# Altium schematic sheet system.SCHDOC
size B
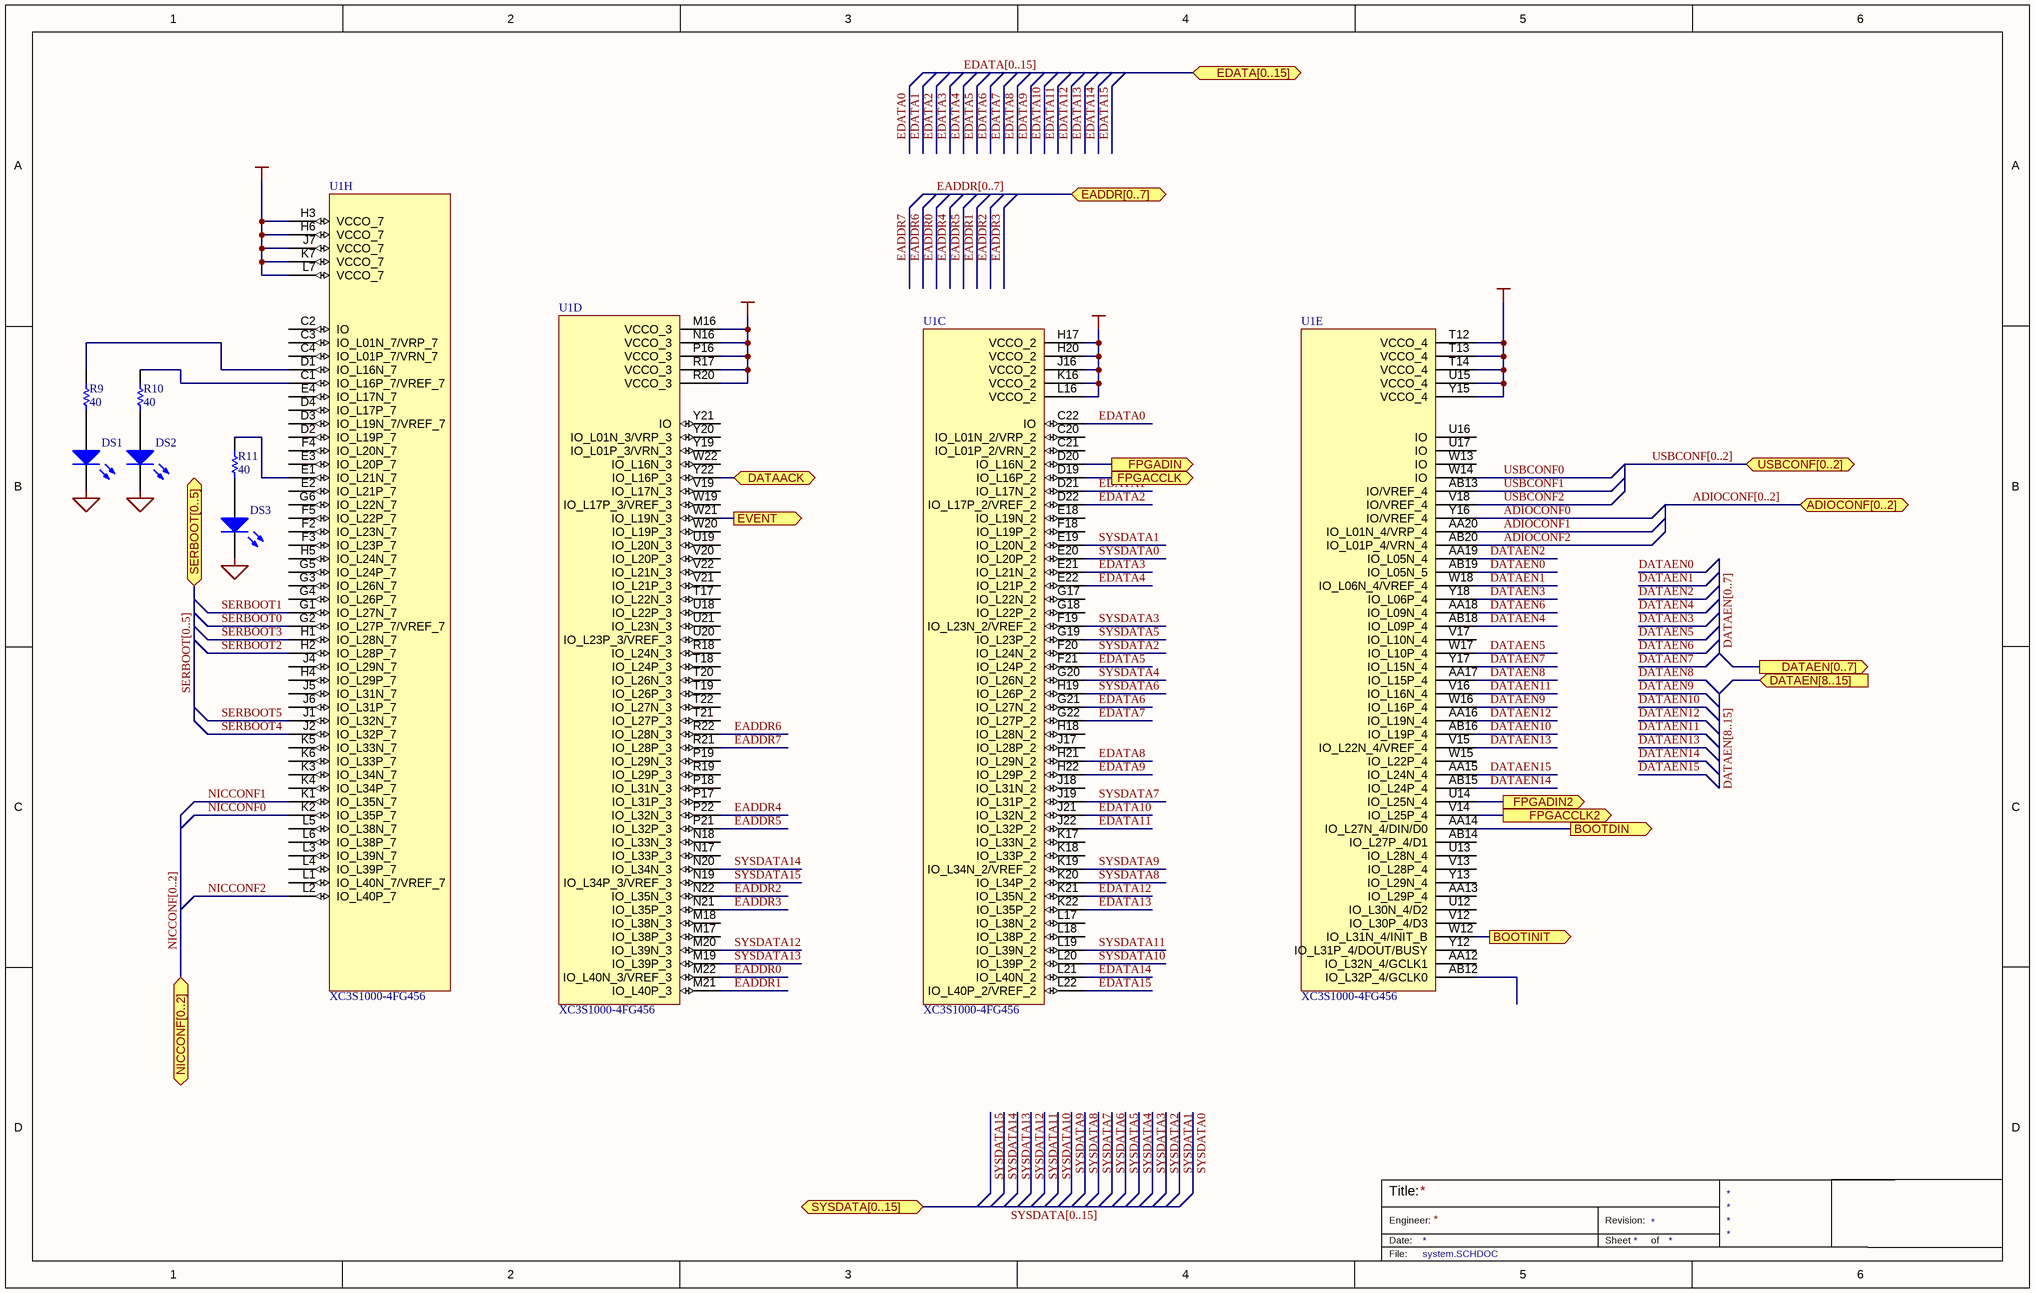
[diagram p0: system.SCHDOC]

## Parts
DS1  LED0  [T-1_LED]  (value not drawn)
DS2  LED0  [T-1_LED]  (value not drawn)
DS3  LED0  [T-1_LED]  (value not drawn)
R9  value 40  [CC1608-0603]  (hidden comment: Res1)
R10  value 40  [CC1608-0603]  (hidden comment: Res1)
R11  value 40  [CC1608-0603]  (hidden comment: Res1)
U1  XC3S1000-4FG456  [FG456]  (parts C,D,E,H of 9)

## Ports
ADIOCONF[0..2] (bidir), BOOTDIN (out), BOOTINIT (out), DATAACK (bidir), DATAEN[0..7] (out), DATAEN[8..15] (in), EADDR[0..7] (bidir), EDATA[0..15] (bidir), EVENT (out), FPGACCLK2 (out), FPGACCLK (out), FPGADIN2 (out), FPGADIN (out), NICCONF[0..2] (bidir), SERBOOT[0..5] (bidir), SYSDATA[0..15] (bidir), USBCONF[0..2] (bidir)

## Nets
GND: DS1.2(K) DS2.2(K) DS3.2(K)
VCC: U1.H3(VCCO_7) U1.H6(VCCO_7) U1.H17(VCCO_2) U1.H20(VCCO_2) U1.J7(VCCO_7) U1.J16(VCCO_2) U1.K7(VCCO_7) U1.K16(VCCO_2) U1.L7(VCCO_7) U1.L16(VCCO_2) U1.M16(VCCO_3) U1.N16(VCCO_3) U1.P16(VCCO_3) U1.R17(VCCO_3) U1.R20(VCCO_3) U1.T12(VCCO_4) U1.T13(VCCO_4) U1.T14(VCCO_4) U1.U15(VCCO_4) U1.Y15(VCCO_4)
ADIOCONF0: U1.Y16(IO/VREF_4)
ADIOCONF1: U1.AA20(IO_L01N_4/VRP_4)
ADIOCONF2: U1.AB20(IO_L01P_4/VRN_4)
BOOTDIN: U1.AA14(IO_L27N_4/DIN/D0) ; port BOOTDIN
BOOTINIT: U1.W12(IO_L31N_4/INIT_B) ; port BOOTINIT
DATAACK: U1.Y22(IO_L16P_3) ; port DATAACK
DATAEN0: U1.AB19(IO_L05N_5)
DATAEN1: U1.W18(IO_L06N_4/VREF_4)
DATAEN2: U1.AA19(IO_L05N_4)
DATAEN3: U1.Y18(IO_L06P_4)
DATAEN4: U1.AB18(IO_L09P_4)
DATAEN5: U1.W17(IO_L10P_4)
DATAEN6: U1.AA18(IO_L09N_4)
DATAEN7: U1.Y17(IO_L15N_4)
DATAEN8: U1.AA17(IO_L15P_4)
DATAEN9: U1.W16(IO_L16P_4)
DATAEN10: U1.AB16(IO_L19P_4)
DATAEN11: U1.V16(IO_L16N_4)
DATAEN12: U1.AA16(IO_L19N_4)
DATAEN13: U1.V15(IO_L22N_4/VREF_4)
DATAEN14: U1.AB15(IO_L24P_4)
DATAEN15: U1.AA15(IO_L24N_4)
EADDR0: U1.M22(IO_L40N_3/VREF_3)
EADDR1: U1.M21(IO_L40P_3)
EADDR2: U1.N22(IO_L35N_3)
EADDR3: U1.N21(IO_L35P_3)
EADDR4: U1.P22(IO_L32N_3)
EADDR5: U1.P21(IO_L32P_3)
EADDR6: U1.R22(IO_L28N_3)
EADDR7: U1.R21(IO_L28P_3)
EDATA0: U1.C22(IO)
EDATA1: U1.D21(IO_L17N_2)
EDATA2: U1.D22(IO_L17P_2/VREF_2)
EDATA3: U1.E21(IO_L21N_2)
EDATA4: U1.E22(IO_L21P_2)
EDATA5: U1.F21(IO_L24P_2)
EDATA6: U1.G21(IO_L27N_2)
EDATA7: U1.G22(IO_L27P_2)
EDATA8: U1.H21(IO_L29N_2)
EDATA9: U1.H22(IO_L29P_2)
EDATA10: U1.J21(IO_L32N_2)
EDATA11: U1.J22(IO_L32P_2)
EDATA12: U1.K21(IO_L35N_2)
EDATA13: U1.K22(IO_L35P_2)
EDATA14: U1.L21(IO_L40N_2)
EDATA15: U1.L22(IO_L40P_2/VREF_2)
EVENT: U1.W21(IO_L19N_3) ; port EVENT
FPGACCLK: U1.D19(IO_L16P_2) ; port FPGACCLK
FPGACCLK2: U1.V14(IO_L25P_4) ; port FPGACCLK2
FPGADIN: U1.D20(IO_L16N_2) ; port FPGADIN
FPGADIN2: U1.U14(IO_L25N_4) ; port FPGADIN2
NICCONF0: U1.K2(IO_L35P_7)
NICCONF1: U1.K1(IO_L35N_7)
NICCONF2: U1.L2(IO_L40P_7)
SERBOOT0: U1.G2(IO_L27P_7/VREF_7)
SERBOOT1: U1.G1(IO_L27N_7)
SERBOOT2: U1.H2(IO_L28P_7)
SERBOOT3: U1.H1(IO_L28N_7)
SERBOOT4: U1.J2(IO_L32P_7)
SERBOOT5: U1.J1(IO_L32N_7)
SYSDATA0: U1.E20(IO_L20P_2)
SYSDATA1: U1.E19(IO_L20N_2)
SYSDATA2: U1.F20(IO_L24N_2)
SYSDATA3: U1.F19(IO_L23N_2/VREF_2)
SYSDATA4: U1.G20(IO_L26N_2)
SYSDATA5: U1.G19(IO_L23P_2)
SYSDATA6: U1.H19(IO_L26P_2)
SYSDATA7: U1.J19(IO_L31P_2)
SYSDATA8: U1.K20(IO_L34P_2)
SYSDATA9: U1.K19(IO_L34N_2/VREF_2)
SYSDATA10: U1.L20(IO_L39P_2)
SYSDATA11: U1.L19(IO_L39N_2)
SYSDATA12: U1.M20(IO_L39N_3)
SYSDATA13: U1.M19(IO_L39P_3)
SYSDATA14: U1.N20(IO_L34N_3)
SYSDATA15: U1.N19(IO_L34P_3/VREF_3)
USBCONF0: U1.W14(IO)
USBCONF1: U1.AB13(IO/VREF_4)
USBCONF2: U1.V18(IO/VREF_4)
NetDS1_1: DS1.1(A) R9.1
NetDS2_1: DS2.1(A) R10.1
NetDS3_1: DS3.1(A) R11.1
NetR9_2: R9.2 U1.D1(IO_L16N_7)
NetR10_2: R10.2 U1.C1(IO_L16P_7/VREF_7)
NetR11_2: R11.2 U1.E1(IO_L21N_7)

Not connected (* = marked no-connect by the designer): U1 AA12(IO_L32N_4/GCLK1) AA13(IO_L29P_4) AB12(IO_L32P_4/GCLK0) AB14(IO_L27P_4/D1) C2(IO) C3(IO_L01N_7/VRP_7) C4(IO_L01P_7/VRN_7) C20(IO_L01N_2/VRP_2) C21(IO_L01P_2/VRN_2) D2(IO_L19P_7) D3(IO_L19N_7/VREF_7) D4(IO_L17P_7) E2(IO_L21P_7) E3(IO_L20P_7) E4(IO_L17N_7) E18(IO_L19N_2) F2(IO_L23N_7) F3(IO_L23P_7) F4(IO_L20N_7) F5(IO_L22P_7) F18(IO_L19P_2) G3(IO_L26N_7) G4(IO_L26P_7) G5(IO_L24P_7) G6(IO_L22N_7) G17(IO_L22N_2) G18(IO_L22P_2) H4(IO_L29P_7) H5(IO_L24N_7) H18(IO_L28N_2) J4(IO_L29N_7) J5(IO_L31N_7) J6(IO_L31P_7) J17(IO_L28P_2) J18(IO_L31N_2) K3(IO_L34N_7) K4(IO_L34P_7) K5(IO_L33N_7) K6(IO_L33P_7) K17(IO_L33N_2) K18(IO_L33P_2) L1(IO_L40N_7/VREF_7) L3(IO_L39N_7) L4(IO_L39P_7) L5(IO_L38N_7) L6(IO_L38P_7) L17(IO_L38N_2) L18(IO_L38P_2) M17(IO_L38P_3) M18(IO_L38N_3) N17(IO_L33P_3) N18(IO_L33N_3) P17(IO_L31P_3) P18(IO_L31N_3) P19(IO_L29N_3) R18(IO_L24N_3) R19(IO_L29P_3) T17(IO_L22N_3) T18(IO_L24P_3) T19(IO_L26P_3) T20(IO_L26N_3) T21(IO_L27P_3) T22(IO_L27N_3) U12(IO_L30N_4/D2) U13(IO_L28N_4) U16(IO) U17(IO) U18(IO_L22P_3) U19(IO_L20N_3) U20(IO_L23P_3/VREF_3) U21(IO_L23N_3) V12(IO_L30P_4/D3) V13(IO_L28P_4) V17(IO_L10N_4) V19(IO_L17N_3) V20(IO_L20P_3) V21(IO_L21P_3) V22(IO_L21N_3) W13(IO) W15(IO_L22P_4) W19(IO_L17P_3/VREF_3) W20(IO_L19P_3) W22(IO_L16N_3) Y12(IO_L31P_4/DOUT/BUSY) Y13(IO_L29N_4) Y19(IO_L01P_3/VRN_3) Y20(IO_L01N_3/VRP_3) Y21(IO)

## Buses and harness runs
bus ADIOCONF[0..2] = port ADIOCONF[0..2]
bus DATAEN[0..7] = port DATAEN[0..7]
bus DATAEN[8..15] = port DATAEN[8..15]
bus EADDR[0..7] = port EADDR[0..7]
bus EDATA[0..15] = port EDATA[0..15]
bus NICCONF[0..2] = port NICCONF[0..2]
bus SERBOOT[0..5] = port SERBOOT[0..5]
bus SYSDATA[0..15] = port SYSDATA[0..15]
bus USBCONF[0..2] = port USBCONF[0..2]

## Notes on the sheet
- Title:
- Engineer:
- Date:
- Revision:
- Sheet
- of
- File:

## Library data of the parts
DS1-DS3 = LED0: Typical INFRARED GaAs LED; Manufacturer: Generic Components; Class I: Optoelectronic; Published: 8-Jun-2000; Revision: July-2002: Re-released for DXP Platform.; Publisher: Altium Limited; Class II: LED
R9-R11 = Res1: Resistor; Manufacturer: Generic Components; Class I: Passive; Published: 8-Jun-2000; Revision: July-2002: Re-released for DXP Platform.; Publisher: Altium Limited; Class II: Resistor
U1 = XC3S1000-4FG456: Xilinx Spartan-3 FPGA; Vendor: Xilinx